# EAGLE schematic electronicDie (EAGLE 9.6.2)
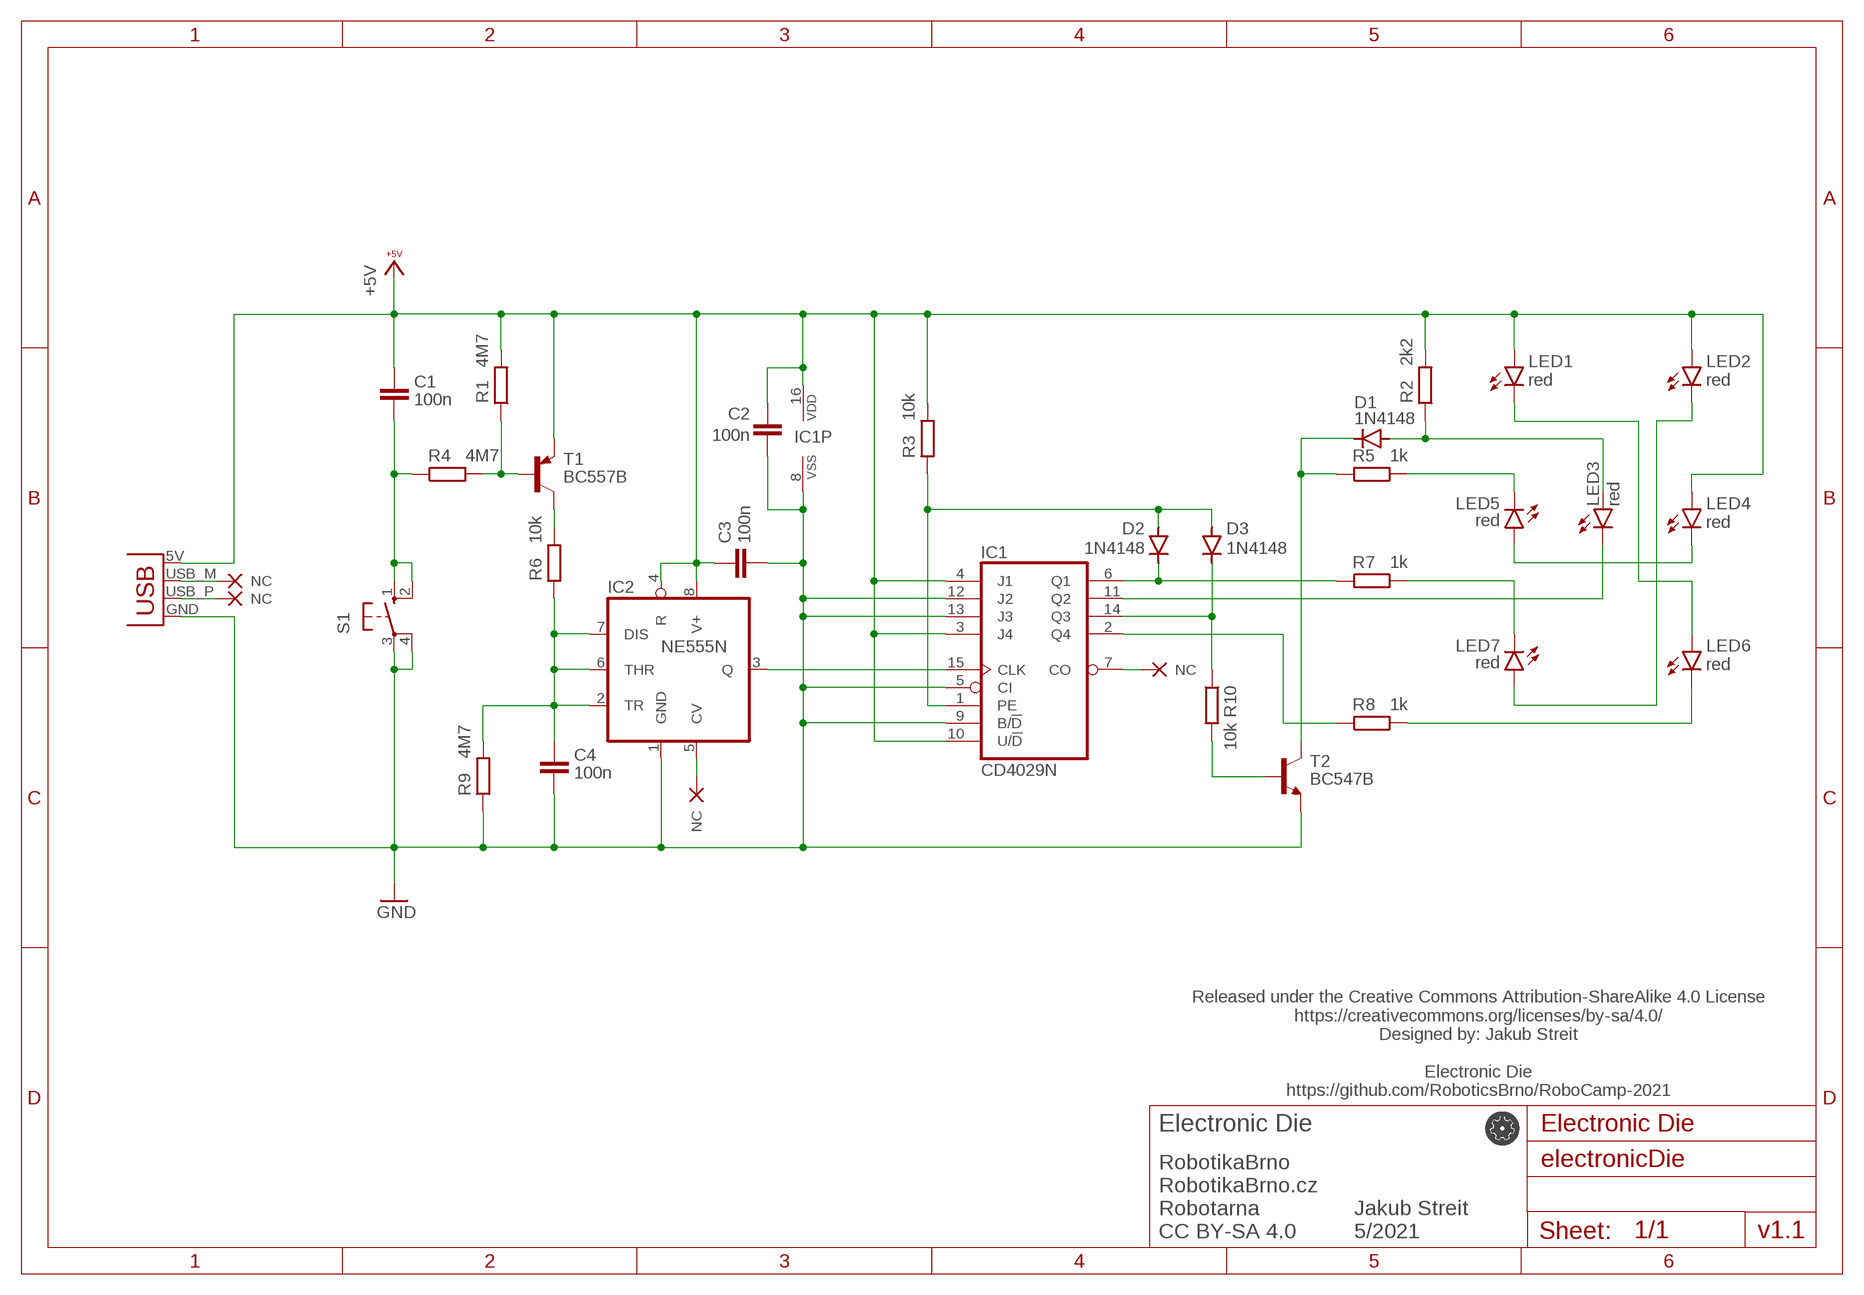
[diagram p0: schematic, sheet 1]

## Parts
C1  100n  C-EU050-024X044  [C050-024X044]
C2  100n  C-EU050-024X044  [C050-024X044]
C3  100n  C-EU050-024X044  [C050-024X044]
C4  100n  C-EU050-024X044  [C050-024X044]
D1  1N4148  1N4148DO35-10  [DO35-10]
D2  1N4148  1N4148DO35-10  [DO35-10]
D3  1N4148  1N4148DO35-10  [DO35-10]
IC1  CD4029N  4029N  [DIL16]
IC2  NE555N  [DIL08]
LED1  red  LED5MM  [LED5MM]
LED2  red  LED5MM  [LED5MM]
LED3  red  LED5MM  [LED5MM]
LED4  red  LED5MM  [LED5MM]
LED5  red  LED5MM  [LED5MM]
LED6  red  LED5MM  [LED5MM]
LED7  red  LED5MM  [LED5MM]
NC1  NC  (no package)
NC2  NC  (no package)
NC3  NC  (no package)
NC4  NC  (no package)
R1  4M7  R-EU_0207/12  [0207/12]
R2  2k2  R-EU_0207/12  [0207/12]
R3  10k  R-EU_0207/12  [0207/12]
R4  4M7  R-EU_0207/12  [0207/12]
R5  1k  R-EU_0207/12  [0207/12]
R6  10k  R-EU_0207/12  [0207/12]
R7  1k  R-EU_0207/12  [0207/12]
R8  1k  R-EU_0207/12  [0207/12]
R9  4M7  R-EU_0207/12  [0207/12]
R10  10k  R-EU_0207/12  [0207/12]
S1  10-XX  [B3F-10XX]
T1  BC557B  2N4126-PNP-TO92-CBE  [TO92-CBE]
T2  BC547B  BC337-16-NPN-TO92-CBE  [TO92-CBE]
X1  USBPCB  [USB-A-PCB]

## Nets
+5V: C1.1 C2.1 C3.1 IC1.3(J4) IC1.4(J1) IC1.10(U/!D) IC1.16(VDD) IC2.4(R) IC2.8(V+) LED1.A LED2.A LED4.A R1.2 R2.2 R3.2 T1.E X1.5V(VBUS)
GND: C2.2 C3.2 C4.2 IC1.5(CI) IC1.8(VSS) IC1.9(B/!D) IC1.12(J2) IC1.13(J3) IC2.1(GND) R9.1 S1.3(P) S1.4(P1) T2.E X1.GND
N$1: C1.2 R4.1 S1.1(S) S1.2(S1)
N$2: R1.1 R4.2 T1.B
N$4: R6.2 T1.C
N$5: C4.1 IC2.2(TR) IC2.6(THR) IC2.7(DIS) R6.1 R9.2
N$6: IC2.5(CV) NC1.NC
N$7: IC1.15(CLK) IC2.3(Q)
N$8: LED7.K(C) R7.2
N$9: D2.A D3.A IC1.1(PE) R3.1
N$10: D2.C IC1.6(Q1) R7.1
N$11: D3.C IC1.14(Q3) R10.1
N$12: IC1.2(Q4) R8.1
N$13: LED4.K(C) LED5.A
N$14: LED2.K(C) LED7.A
N$15: IC1.7(CO) NC2.NC
N$16: LED1.K(C) LED6.A
N$17: R10.2 T2.B
N$18: LED5.K(C) R5.2
N$19: D1.A LED3.A R2.1
N$20: IC1.11(Q2) LED3.K(C)
N$21: D1.C R5.1 T2.C
N$22: LED6.K(C) R8.2
N$23: NC3.NC X1.USB_M(D-)
N$24: NC4.NC X1.USB_P(D+)

## Notes on the sheet
- Released under the Creative Commons Attribution-ShareAlike 4.0 License
  https://creativecommons.org/licenses/by-sa/4.0/
  Designed by: Jakub Streit
  
  Electronic Die
  https://github.com/RoboticsBrno/RoboCamp-2021
- Electronic Die
- RobotikaBrno
  RobotikaBrno.cz
  Robotarna
  CC BY-SA 4.0
- Jakub Streit
  5/2021
- v1.1

## Library data of the parts
C1-C4 = rcl_upravena:C-EU: CAPACITOR, European symbol
D1-D3 = diode:1N4148: DIODE high speed (Philips)
IC1 = 40xx:4029: Binary/decimal up/down COUNTER
IC2 = 555:*555: TIMER
LED1-LED7 = led:LED: LED
NC1-NC4 = NC:NC: _EXTERNAL_
R1-R10 = rcl_upravena:R-EU_: RESISTOR, European symbol
S1 = switch-omron:10-XX: OMRON SWITCH; MPN: B3F-1000; OC_FARNELL: 176432; OC_NEWARK: 36M3542
T1 = transistor:*-PNP-: PNP Transistror
T2 = transistor:*-NPN-: NPN Transistror BF959 corrected 2008.03.06
X1 = USB:USB: USB Connectors USB-B-PTH is fully proven SKU : PRT-00139 USB-miniB is fully proven SKU : PRT-00587 USB-A-PCB is untested. USB-A-H is throughly reviewed, but untested. Spark Fun Electronics SKU : PRT-00437 USB-B-SMT is throughly reviewed, but untested. Needs silkscreen touching up. USB-A-S has not been used/tested USB-MB-H has not been used/tested